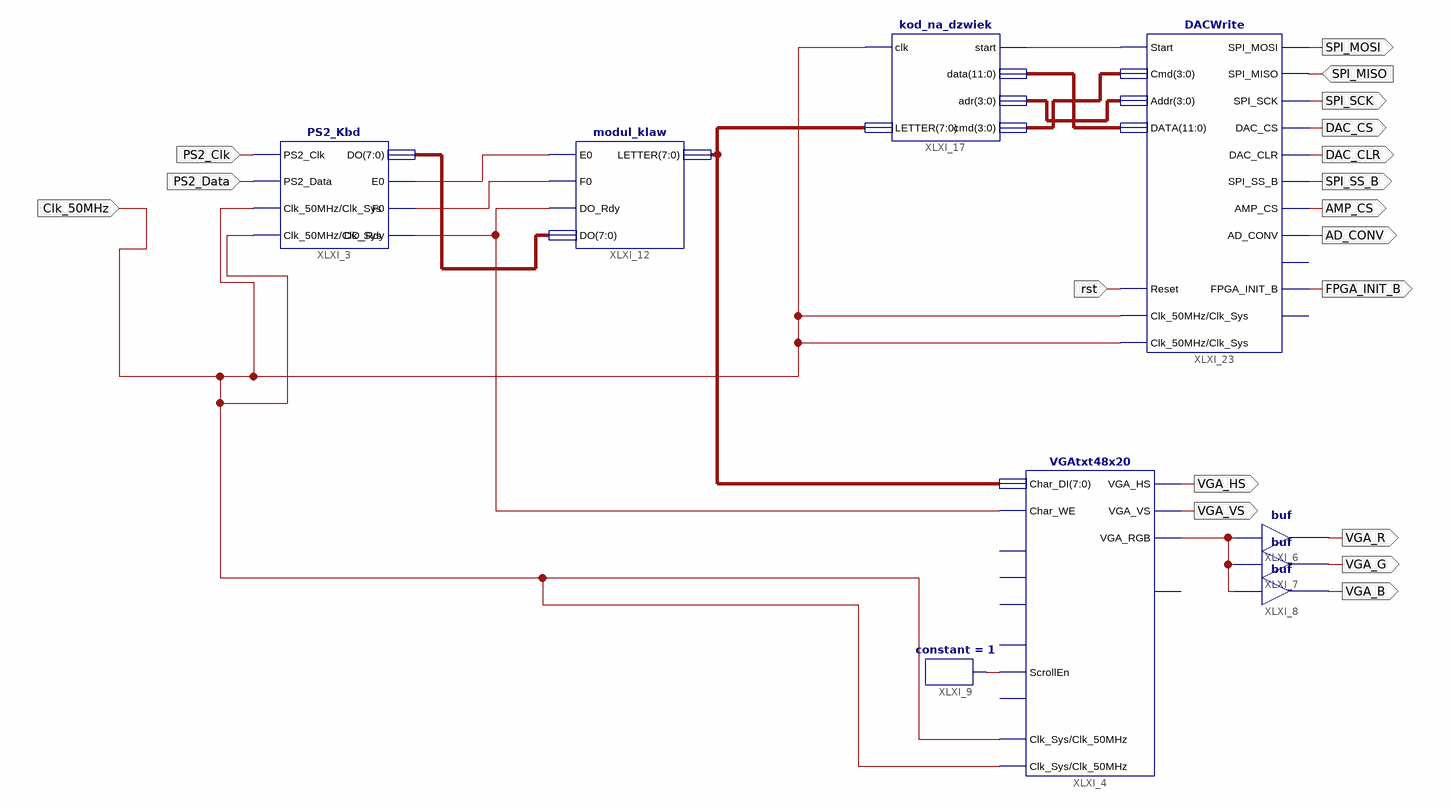
[diagram p0: schematic sheet 1]
// Xilinx ISE schematic main.sch (spartan3e) as structural Verilog: 9 symbols, 18 ports
module main (
  input  PS2_Data,
  input  PS2_Clk,
  input  Clk_50MHz,
  input  rst,
  input  SPI_MISO,
  output VGA_HS,
  output VGA_VS,
  output VGA_R,
  output VGA_G,
  output VGA_B,
  output SPI_MOSI,
  output DAC_CS,
  output SPI_SCK,
  output DAC_CLR,
  output SPI_SS_B,
  output AMP_CS,
  output FPGA_INIT_B,
  output AD_CONV
);

  wire XLXN_5, XLXN_16, XLXN_27, XLXN_28, XLXN_50, XLXN_68;
  wire [3:0] XLXN_66, XLXN_67;
  wire [7:0] XLXN_26, XLXN_31;
  wire [11:0] XLXN_65;

  PS2_Kbd XLXI_3 (
    .PS2_Clk(PS2_Clk), .PS2_Data(PS2_Data), .Clk_50MHz(Clk_50MHz), .E0(XLXN_27), .F0(XLXN_28),
    .DO_Rdy(XLXN_50), .DO(XLXN_31), .Clk_Sys(Clk_50MHz));
  modul_klaw XLXI_12 (.E0(XLXN_27), .F0(XLXN_28), .DO_Rdy(XLXN_50), .DO(XLXN_31), .LETTER(XLXN_26));
  kod_na_dzwiek XLXI_17 (
    .clk(Clk_50MHz), .LETTER(XLXN_26), .start(XLXN_68), .data(XLXN_65), .adr(XLXN_67), .cmd(XLXN_66));
  VGAtxt48x20 XLXI_4 (
    .Char_DI(XLXN_26), .Clk_Sys(Clk_50MHz), .Clk_50MHz(Clk_50MHz), .ScrollEn(XLXN_16), .VGA_HS(VGA_HS),
    .VGA_VS(VGA_VS), .VGA_RGB(XLXN_5), .Char_WE(XLXN_50));  // open: Home, NewLine, Goto00, CursorOn, ScrollClear, Busy
  buf XLXI_6 (VGA_R, XLXN_5);
  buf XLXI_7 (VGA_G, XLXN_5);
  buf XLXI_8 (VGA_B, XLXN_5);
  constant #(.CValue("1")) XLXI_9 (.O(XLXN_16));
  DACWrite XLXI_23 (
    .Reset(rst), .Start(XLXN_68), .SPI_MISO(SPI_MISO), .Cmd(XLXN_66), .Addr(XLXN_67), .DATA(XLXN_65),
    .DAC_CLR(DAC_CLR), .DAC_CS(DAC_CS), .SPI_MOSI(SPI_MOSI), .SPI_SCK(SPI_SCK), .SPI_SS_B(SPI_SS_B),
    .AMP_CS(AMP_CS), .AD_CONV(AD_CONV), .FPGA_INIT_B(FPGA_INIT_B), .Clk_50MHz(Clk_50MHz), .Clk_Sys(Clk_50MHz));  // open: SF_CE0, Busy
endmodule
